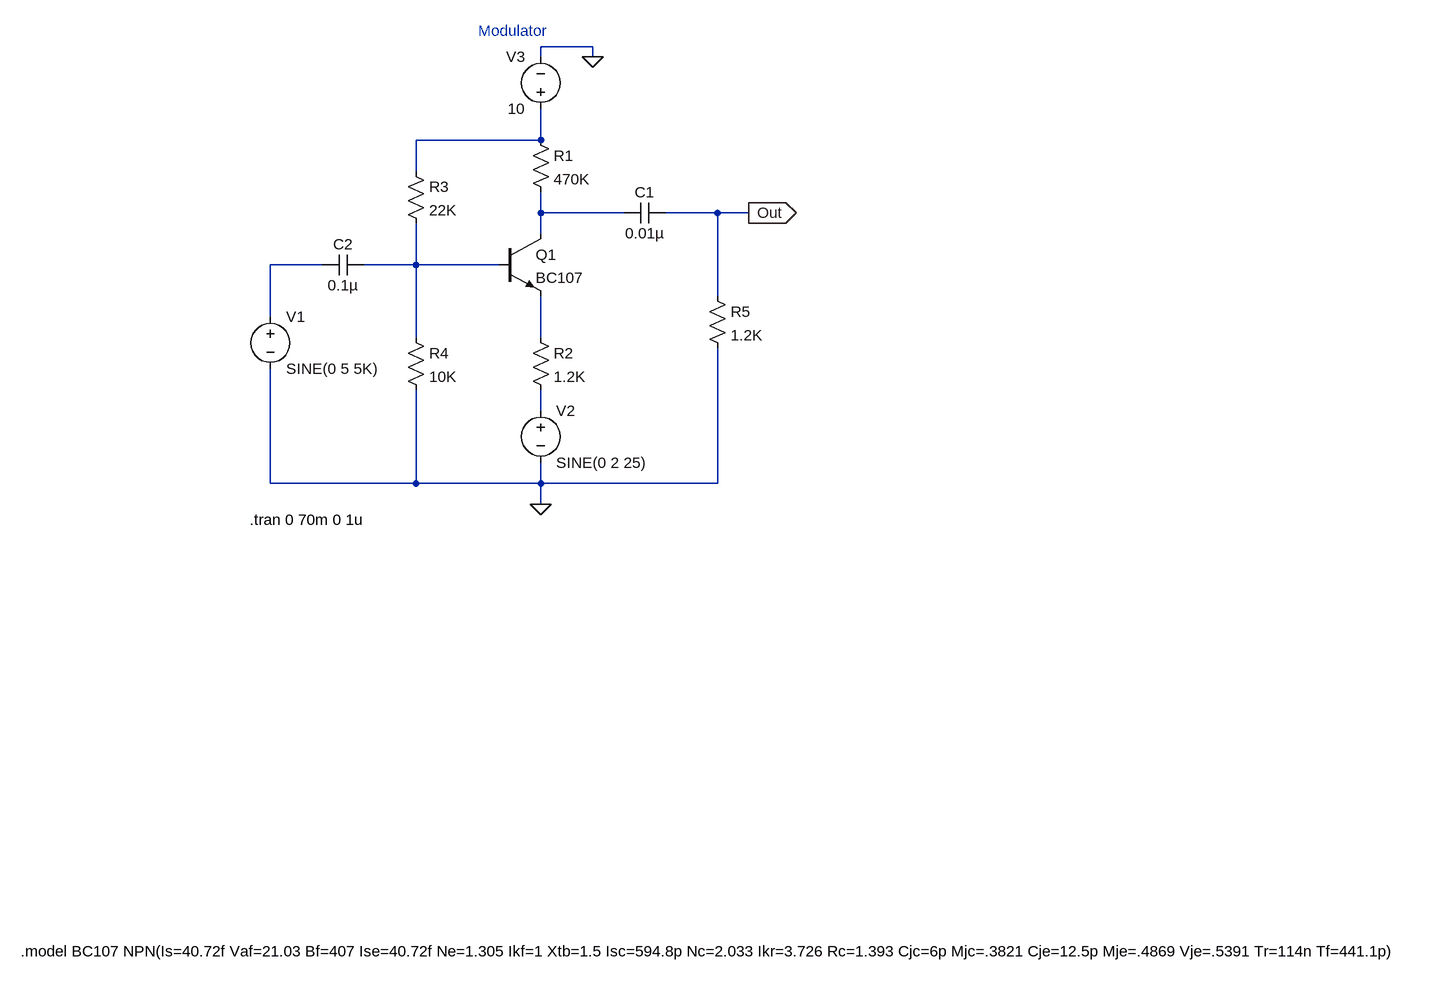
[diagram p0: schematic modulator.asc]
modulator.asc, the LTspice schematic file:
Version 4.1
SHEET 1 2096 1216
WIRE 304 -192 224 -192
WIRE 224 -176 224 -192
WIRE 304 -176 304 -192
WIRE 224 -48 224 -96
WIRE 224 -48 32 -48
WIRE 32 0 32 -48
WIRE 224 64 224 32
WIRE 352 64 224 64
WIRE 496 64 416 64
WIRE 544 64 496 64
WIRE 224 96 224 64
WIRE -112 144 -192 144
WIRE 32 144 32 80
WIRE 32 144 -48 144
WIRE 160 144 32 144
WIRE 496 192 496 64
WIRE -192 224 -192 144
WIRE 32 256 32 144
WIRE 224 256 224 192
WIRE 224 368 224 336
WIRE -192 480 -192 304
WIRE 32 480 32 336
WIRE 32 480 -192 480
WIRE 224 480 224 448
WIRE 224 480 32 480
WIRE 496 480 496 272
WIRE 496 480 224 480
WIRE 224 512 224 480
FLAG 224 512 0
FLAG 304 -176 0
FLAG 544 64 Out
IOPIN 544 64 Out
SYMBOL npn 160 96 R0
SYMATTR InstName Q1
SYMATTR Value BC107
SYMBOL res 208 -64 R0
SYMATTR InstName R1
SYMATTR Value 470K
SYMBOL res 208 240 R0
SYMATTR InstName R2
SYMATTR Value 1.2K
SYMBOL res 16 -16 R0
SYMATTR InstName R3
SYMATTR Value 22K
SYMBOL res 16 240 R0
SYMATTR InstName R4
SYMATTR Value 10K
SYMBOL res 480 176 R0
SYMATTR InstName R5
SYMATTR Value 1.2K
SYMBOL cap 416 48 R90
WINDOW 0 0 32 VBottom 2
WINDOW 3 32 32 VTop 2
SYMATTR InstName C1
SYMATTR Value 0.01µ
SYMBOL cap -48 128 R90
WINDOW 0 0 32 VBottom 2
WINDOW 3 32 32 VTop 2
SYMATTR InstName C2
SYMATTR Value 0.1µ
SYMBOL voltage -192 208 R0
WINDOW 123 0 0 Left 0
WINDOW 39 0 0 Left 0
SYMATTR InstName V1
SYMATTR Value SINE(0 5 5K)
SYMBOL voltage 224 352 R0
WINDOW 123 0 0 Left 0
WINDOW 39 0 0 Left 0
SYMATTR InstName V2
SYMATTR Value SINE(0 2 25)
SYMBOL voltage 224 -80 R180
WINDOW 0 24 96 Left 2
WINDOW 3 24 16 Left 2
SYMATTR InstName V3
SYMATTR Value 10
TEXT -224 536 Left 2 !.tran 0 70m 0 1u
TEXT -576 1200 Left 2 !.model BC107 NPN(Is=40.72f Vaf=21.03 Bf=407 Ise=40.72f Ne=1.305 Ikf=1 Xtb=1.5 Isc=594.8p Nc=2.033 Ikr=3.726 Rc=1.393 Cjc=6p Mjc=.3821 Cje=12.5p Mje=.4869 Vje=.5391 Tr=114n Tf=441.1p)
TEXT 128 -216 Left 2 ;Modulator

The netlist it stands for:
* modulator.asc
Q1 N002 N004 N005 0 BC107
R1 N001 N002 470K
R2 N005 N006 1.2K
R3 N001 N004 22K
R4 N004 0 10K
R5 Out 0 1.2K
C1 Out N002 0.01µ
C2 N004 N003 0.1µ
V1 N003 0 SINE(0 5 5K)
V2 N006 0 SINE(0 2 25)
V3 N001 0 10
.model NPN NPN
.model PNP PNP
.lib standard.bjt
.tran 0 70m 0 1u
.model BC107 NPN(Is=40.72f Vaf=21.03 Bf=407 Ise=40.72f Ne=1.305 Ikf=1 Xtb=1.5 Isc=594.8p Nc=2.033 Ikr=3.726 Rc=1.393 Cjc=6p Mjc=.3821 Cje=12.5p Mje=.4869 Vje=.5391 Tr=114n Tf=441.1p)
* Modulator
.backanno
.end